# Altium schematic sheet BatteryMonitor.SchDoc
size A4
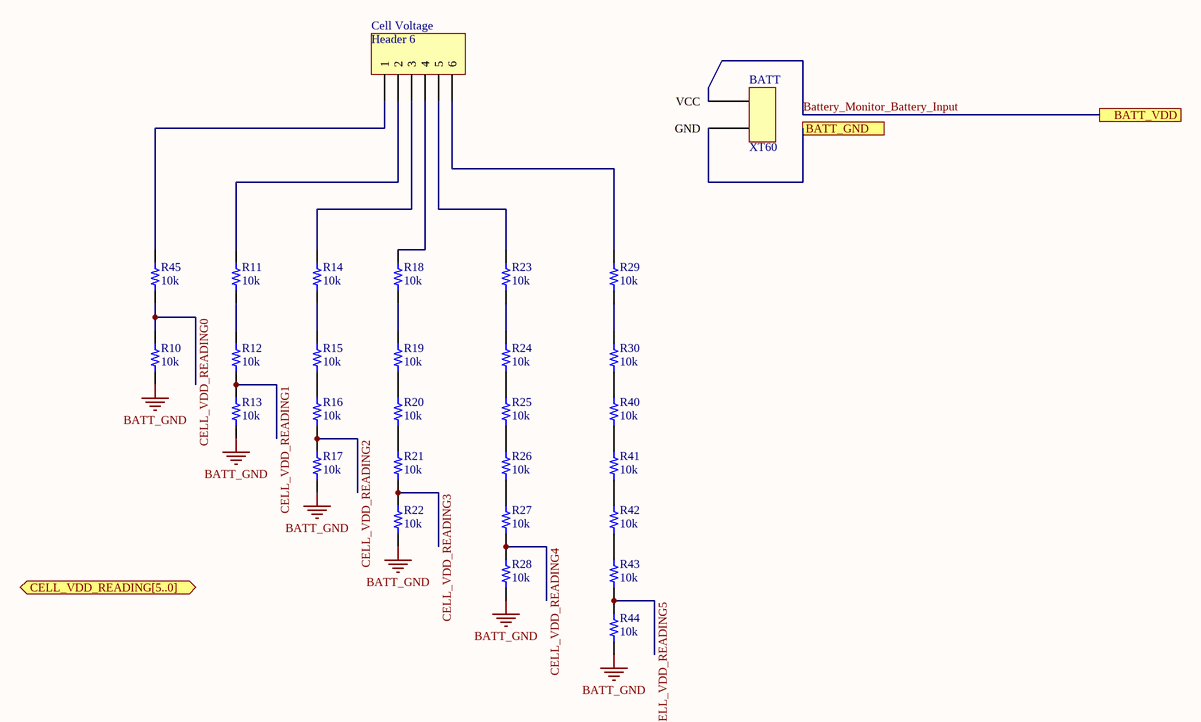
[diagram p0: BatteryMonitor.SchDoc]

## Parts
BATT  XT60  [XT60]
Cell_Voltage  Header 6  [HDR1X6]
R10  10k  [RES 0402/1005]
R11  10k  [RES 0402/1005]
R12  10k  [RES 0402/1005]
R13  10k  [RES 0402/1005]
R14  10k  [RES 0402/1005]
R15  10k  [RES 0402/1005]
R16  10k  [RES 0402/1005]
R17  10k  [RES 0402/1005]
R18  10k  [RES 0402/1005]
R19  10k  [RES 0402/1005]
R20  10k  [RES 0402/1005]
R21  10k  [RES 0402/1005]
R22  10k  [RES 0402/1005]
R23  10k  [RES 0402/1005]
R24  10k  [RES 0402/1005]
R25  10k  [RES 0402/1005]
R26  10k  [RES 0402/1005]
R27  10k  [RES 0402/1005]
R28  10k  [RES 0402/1005]
R29  10k  [RES 0402/1005]
R30  10k  [RES 0402/1005]
R40  10k  [RES 0402/1005]
R41  10k  [RES 0402/1005]
R42  10k  [RES 0402/1005]
R43  10k  [RES 0402/1005]
R44  10k  [RES 0402/1005]
R45  10k  [RES 0402/1005]

## Ports
BATT_GND, BATT_VDD, CELL_VDD_READING[5..0]

## Nets
BATT_GND: R10.1 R13.1 R17.1 R22.1 R28.1 R44.1
Battery_Monitor_Battery_Input: port BATT_VDD
CELL_VDD_READING0: R10.2 R45.1
CELL_VDD_READING1: R12.1 R13.2
CELL_VDD_READING2: R16.1 R17.2
CELL_VDD_READING3: R21.1 R22.2
CELL_VDD_READING4: R27.1 R28.2
CELL_VDD_READING5: R43.1 R44.2
NetCell_Voltage_1: Cell_Voltage.1 R45.2
NetCell_Voltage_2: Cell_Voltage.2 R11.2
NetCell_Voltage_3: Cell_Voltage.3 R14.2
NetCell_Voltage_4: Cell_Voltage.4 R18.2
NetCell_Voltage_5: Cell_Voltage.5 R23.2
NetCell_Voltage_6: Cell_Voltage.6 R29.2
NetR11_1: R11.1 R12.2
NetR14_1: R14.1 R15.2
NetR15_1: R15.1 R16.2
NetR18_1: R18.1 R19.2
NetR19_1: R19.1 R20.2
NetR20_1: R20.1 R21.2
NetR23_1: R23.1 R24.2
NetR24_1: R24.1 R25.2
NetR25_1: R25.1 R26.2
NetR26_1: R26.1 R27.2
NetR29_1: R29.1 R30.2
NetR30_1: R30.1 R40.2
NetR40_1: R40.1 R41.2
NetR41_1: R41.1 R42.2
NetR42_1: R42.1 R43.2

Not connected (* = marked no-connect by the designer): BATT GND VCC

## Notes on the sheet
- Title
- Size:
- Date:
- A4
- Number:
- Time:
- Revision:
- Sheet
- of
- File:

## Library data of the parts
Cell_Voltage = Header 6: Header, 6-Pin; LatestRevisionDate: 17-Jul-2002; LatestRevisionNote: Re-released for DXP Platform.; Publisher: Altium Limited
R10-R30 R40-R45 = ERJ-2RKF1002X: RES SMD 10K OHM 1% 1/10W 0402; Manufacturer: Panasonic Electronic Components; TemperatureRange: -55C ~ 155C; TemperatureCoefficient: 100ppm/C; PowerRating: 0.1W, 1/10W; Value: 10k; Part Number: ERJ-2RKF1002X; PartId: 1; Supplier 1: Digi-Key; Supplier Part Number 1: P10.0KLTR-ND; ComponentLink1Description: Datasheet; ComponentLink1URL: http://industrial.panasonic.com/www-cgi/jvcr13pz.cgi?E+PZ+3+AOA0002+ERJ2RKF1002X+7+WW; ComponentLink2Description: Digikey listing; ComponentLink2URL: http://digikey.com/product-detail/en/ERJ-2RKF1002X/P10.0KLTR-ND/192073; Tolerance: 1%; Price: 0.0043; Type: Thick Film; Device Package: 0402 (1005 Metric)